# EAGLE schematic untitled3 (EAGLE 9.6.2)
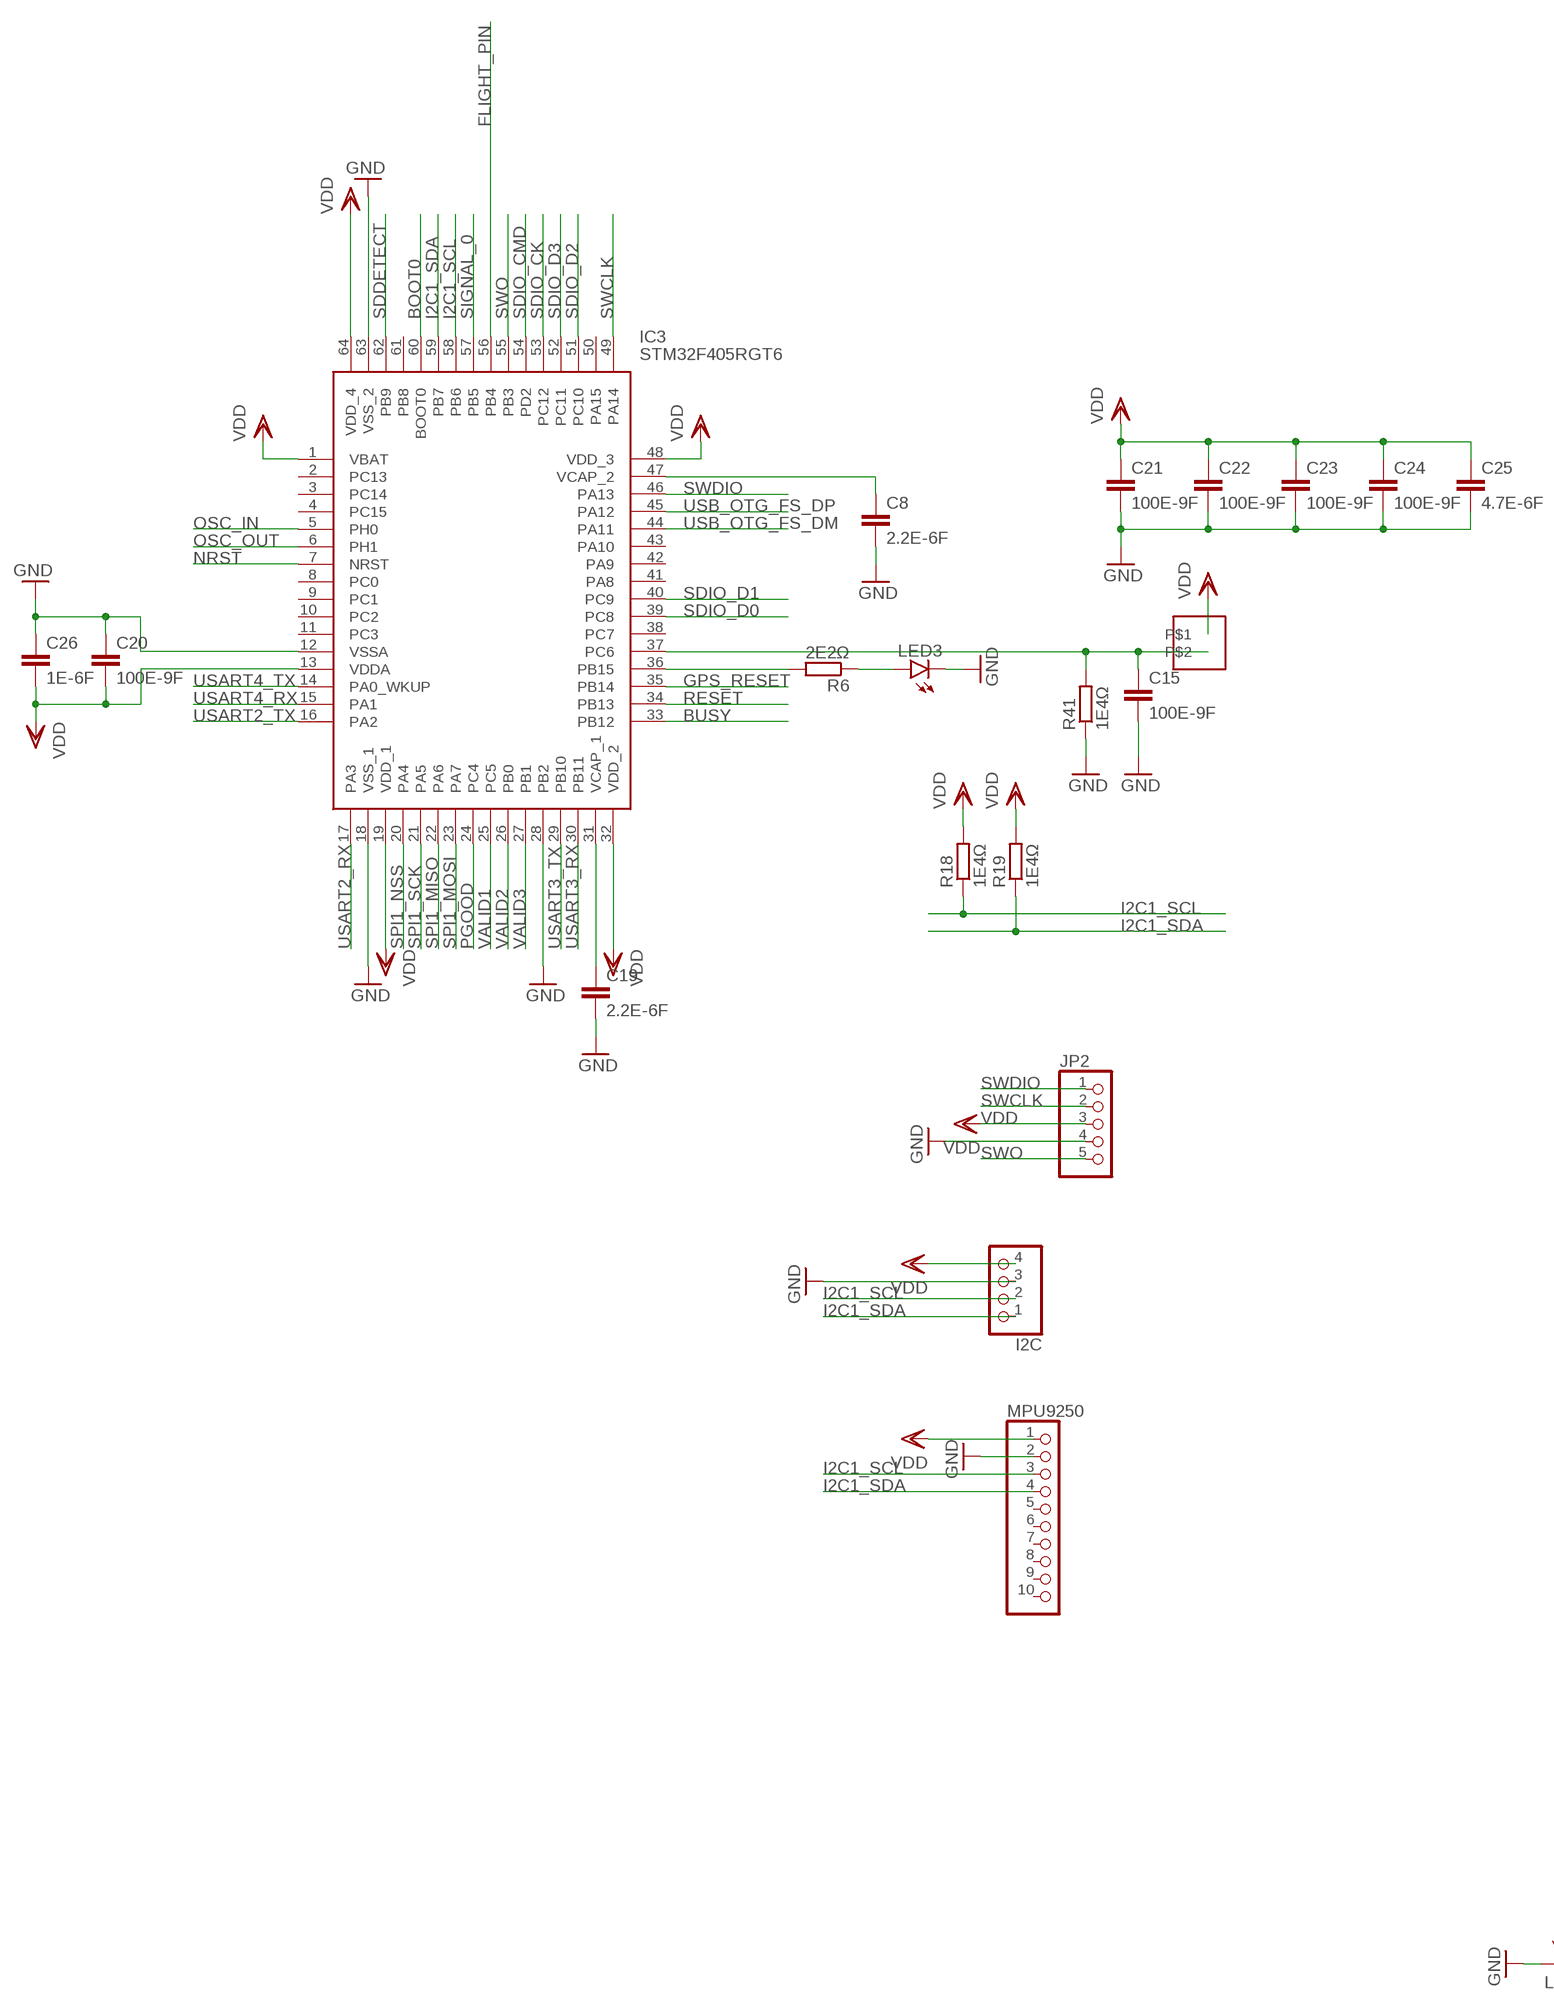
[diagram p0: schematic, sheet 1, part 1 of 2]
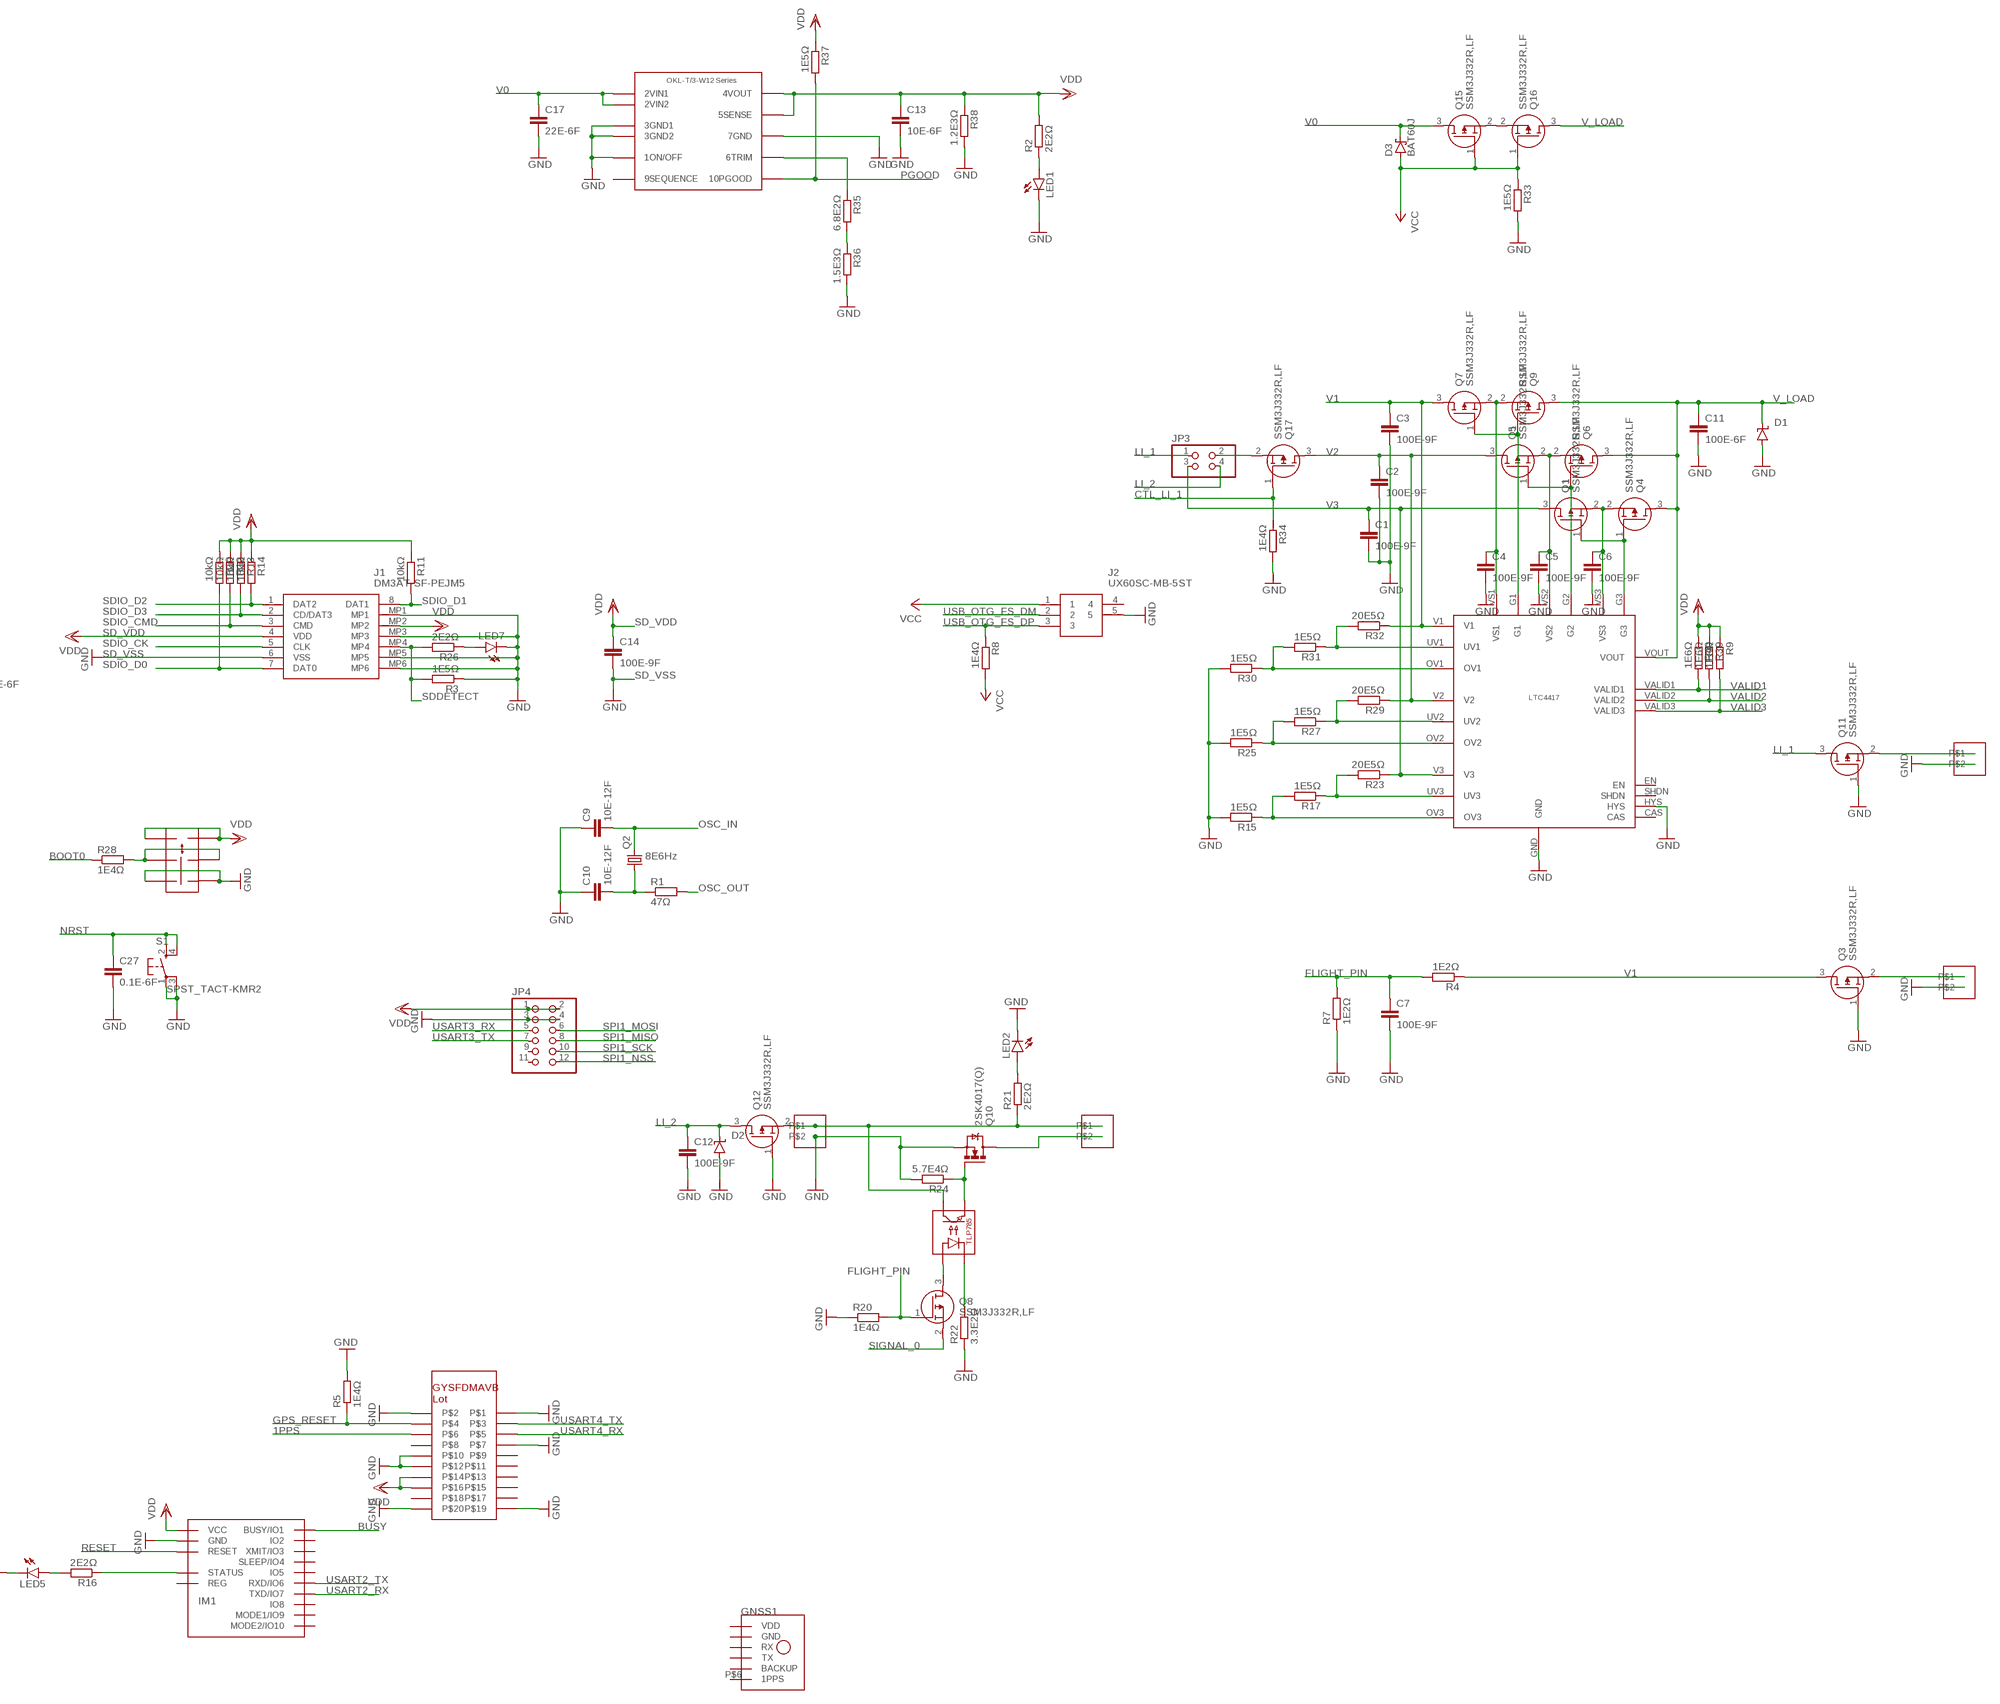
[diagram p1: schematic, sheet 1, part 2 of 2]

## Parts
C1  100E-9F  C-EUC0805  [C0805]
C2  100E-9F  C-EUC0805  [C0805]
C3  100E-9F  C-EUC0805  [C0805]
C4  100E-9F  C-EUC0805  [C0805]
C5  100E-9F  C-EUC0805  [C0805]
C6  100E-9F  C-EUC0805  [C0805]
C7  100E-9F  C-EUC0805  [C0805]
C8  2.2E-6F  C-EUC0805  [C0805]
C9  10E-12F  C-EUC0805  [C0805]
C10  10E-12F  C-EUC0805  [C0805]
C11  100E-6F  C-EUC0805  [C0805]
C12  100E-9F  C-EUC0805  [C0805]
C13  10E-6F  C-EUC0805  [C0805]
C14  100E-9F  C-EUC0805  [C0805]
C15  100E-9F  C-EUC0805  [C0805]
C17  22E-6F  C-EUC0805  [C0805]
C19  2.2E-6F  C-EUC0805  [C0805]
C20  100E-9F  C-EUC0805  [C0805]
C21  100E-9F  C-EUC0805  [C0805]
C22  100E-9F  C-EUC0805  [C0805]
C23  100E-9F  C-EUC0805  [C0805]
C24  100E-9F  C-EUC0805  [C0805]
C25  4.7E-6F  C-EUC0805  [C0805]
C26  1E-6F  C-EUC0805  [C0805]
C27  0.1E-6F  C-EUC0805  [C0805]
D1  SUPPRESSOR-SMBJ  [SMBJ]
D2  SUPPRESSOR-SMBJ  [SMBJ]
D3  BAT60J  [SOD323_ST]
GNSS1  GYSFDMAXB  [GYSFDMAXB]
I2C  PINHD-1X4  [1X04]
IC3  STM32F405RGT6  [QFP50P1200X1200X160-64N]
IM1  IM920C  [IM920C]
J1  DM3AT-SF-PEJM5  [DM3ATSFPEJM5]
J2  UX60SC-MB-5ST  [UX60SC-MB-5ST]
JP2  PINHD-1X5  [1X05]
JP3  PINHD-2X2  [2X02]
JP4  PINHD-2X6  [2X06]
LED1  LEDCHIP-LED0805  [CHIP-LED0805]
LED2  LEDCHIP-LED0805  [CHIP-LED0805]
LED3  LEDCHIP-LED0805  [CHIP-LED0805]
LED5  LEDCHIP-LED0805  [CHIP-LED0805]
LED7  LEDCHIP-LED0805  [CHIP-LED0805]
MPU9250  PINHD-1X10  [1X10]
Q1  SSM3J332R,LF  [2-3Z1S(SOT-23F)]
Q2  CRYSTALCTS406  [CTS406]
Q3  SSM3J332R,LF  [2-3Z1S(SOT-23F)]
Q4  SSM3J332R,LF  [2-3Z1S(SOT-23F)]
Q5  SSM3J332R,LF  [2-3Z1S(SOT-23F)]
Q6  SSM3J332R,LF  [2-3Z1S(SOT-23F)]
Q7  SSM3J332R,LF  [2-3Z1S(SOT-23F)]
Q8  SSM3J332R,LF  [2-3Z1S(SOT-23F)]
Q9  SSM3J332R,LF  [2-3Z1S(SOT-23F)]
Q10  2SK4017(Q)  [TO230P230X650X740-3P]
Q11  SSM3J332R,LF  [2-3Z1S(SOT-23F)]
Q12  SSM3J332R,LF  [2-3Z1S(SOT-23F)]
Q15  SSM3J332R,LF  [2-3Z1S(SOT-23F)]
Q16  SSM3J332R,LF  [2-3Z1S(SOT-23F)]
Q17  SSM3J332R,LF  [2-3Z1S(SOT-23F)]
R1  47Ω  R-EU_R0603  [R0603]
R2  2E2Ω  R-EU_R0603  [R0603]
R3  1E5Ω  R-EU_R0603  [R0603]
R4  1E2Ω  R-EU_R0603  [R0603]
R5  1E4Ω  R-EU_R0603  [R0603]
R6  2E2Ω  R-EU_R0603  [R0603]
R7  1E2Ω  R-EU_R0603  [R0603]
R8  1E4Ω  R-EU_R0603  [R0603]
R9  1E6Ω  R-EU_R0603  [R0603]
R10  10kΩ  R-EU_R0603  [R0603]
R11  10kΩ  R-EU_R0603  [R0603]
R12  10kΩ  R-EU_R0603  [R0603]
R13  10kΩ  R-EU_R0603  [R0603]
R14  10kΩ  R-EU_R0603  [R0603]
R15  1E5Ω  R-EU_R0603  [R0603]
R16  2E2Ω  R-EU_R0603  [R0603]
R17  1E5Ω  R-EU_R0603  [R0603]
R18  1E4Ω  R-EU_R0603  [R0603]
R19  1E4Ω  R-EU_R0603  [R0603]
R20  1E4Ω  R-EU_R0603  [R0603]
R21  2E2Ω  R-EU_R0603  [R0603]
R22  3.3E2Ω  R-EU_R0603  [R0603]
R23  20E5Ω  R-EU_R0603  [R0603]
R24  5.7E4Ω  R-EU_R0603  [R0603]
R25  1E5Ω  R-EU_R0603  [R0603]
R26  2E2Ω  R-EU_R0603  [R0603]
R27  1E5Ω  R-EU_R0603  [R0603]
R28  1E4Ω  R-EU_R0603  [R0603]
R29  20E5Ω  R-EU_R0603  [R0603]
R30  1E5Ω  R-EU_R0603  [R0603]
R31  1E5Ω  R-EU_R0603  [R0603]
R32  20E5Ω  R-EU_R0603  [R0603]
R33  1E5Ω  R-EU_R0603  [R0603]
R34  1E4Ω  R-EU_R0603  [R0603]
R35  6.8E2Ω  R-EU_R0603  [R0603]
R36  1.5E3Ω  R-EU_R0603  [R0603]
R37  1E5Ω  R-EU_R0603  [R0603]
R38  1.2E3Ω  R-EU_R0603  [R0603]
R39  1E6Ω  R-EU_R0603  [R0603]
R40  1E6Ω  R-EU_R0603  [R0603]
R41  1E4Ω  R-EU_R0603  [R0603]
S1  SPST_TACT-KMR2  [KMR2]
TRANSISTER2  TLP785  [TLP785]
U$1  B2B-XH-A  [B2B-XH-A]
U$2  LTC4417  [LTC4417]
U$3  OKL-T/3-W12SERIES  [OKL-T/3-W12SERIES]
U$4  GYSFDMAXB_LOT  [GYSFDMAXB_LOT]
U$6  B2B-XH-A  [B2B-XH-A]
U$7  B2B-XH-A  [B2B-XH-A]
U$8  B2B-XH-A  [B2B-XH-A]
U$9  SSSS213202  [SSSS213202]
U$10  B2B-XH-A  [B2B-XH-A]

## Nets
1PPS: U$4.P$6
BOOT0: IC3.60(BOOT0) R28.1
BUSY: IC3.33(PB12) IM1.$P1(BUSY/IO1)
CTL_LI_1: Q17.1(G) R34.1
FLIGHT_PIN: C7.1 IC3.56(PB4) Q8.1(G) R4.2 R7.2 R20.2
GND [VCC]: C1.2 C2.2 C3.2 C4.2 C5.2 C6.2 C7.2 C8.2 C9.1 C10.1 C11.2 C12.2 C13.2 C14.2 C15.2 C17.2 C19.2 C20.1 C21.2 C22.2 C23.2 C24.2 C25.2 C26.1 C27.2 D1.A D2.A I2C.3 IC3.12(VSSA) IC3.18(VSS_1) IC3.28(PB2) IC3.63(VSS_2) IM1.$P18(GND) J1.6(VSS) J1.MP1 J1.MP3 J1.MP5 J1.MP6 J2.5 JP2.4 JP4.3 JP4.4 LED1.C LED2.C LED3.C LED5.C LED7.C MPU9250.2 Q3.1(G) Q10.3(S) Q11.1(G) Q12.1(G) R3.1 R5.2 R7.1 R15.2 R20.1 R22.1 R24.2 R25.2 R30.2 R33.2 R34.2 R36.2 R38.2 R41.1 S1.1(P) S1.3(P1) U$1.P$2 U$2.GND U$2.HYS U$3.1ON/OFF U$3.3GND1 U$3.3TGND2(3GND2) U$3.7GND U$4.P$1 U$4.P$2 U$4.P$7 U$4.P$10 U$4.P$12 U$4.P$19 U$4.P$20 U$6.P$2 U$8.P$2 U$9.P$5 U$9.P$6
GPS_RESET: IC3.35(PB14) R5.1 U$4.P$4
I2C1_SCL: I2C.2 IC3.58(PB6) MPU9250.3 R18.1
I2C1_SDA: I2C.1 IC3.59(PB7) MPU9250.4 R19.1
LI_1: JP3.1 Q11.3(D)
LI_2: C12.1 D2.C JP3.4 Q12.3(D)
N$1: LED5.A R16.2
N$2: LED1.A R2.1
N$3: IC3.36(PB15) R6.2
N$4: Q11.2(S) U$1.P$1
N$5 [VCC]: C15.1 IC3.37(PC6) R41.2 U$10.P$2
N$6: R15.1 R17.2 U$2.OV3
N$7: C10.2 Q2.1 R1.1
N$8: LED3.A R6.1
N$9: R17.1 R23.2 U$2.UV3
N$10: Q1.1(G) Q4.1(G) U$2.G3
N$11: R30.1 R31.2 U$2.OV1
N$12: R31.1 R32.2 U$2.UV1
N$13: R28.2 U$9.P$3 U$9.P$4
N$14 [VCC]: Q10.2(D) U$7.P$2
N$15: R27.1 R29.2 U$2.UV2
N$16: R25.1 R27.2 U$2.OV2
N$17: C6.1 Q1.2(S) Q4.2(S) U$2.VS3
N$18 [VIN]: Q3.2(S) U$6.P$1
N$20: Q12.2(S) R21.1 TRANSISTER2.P$3 U$7.P$1 U$8.P$1
N$21: C5.1 Q5.2(S) Q6.2(S) U$2.VS2
N$22: Q5.1(G) Q6.1(G) U$2.G2
N$23: C4.1 Q7.2(S) Q9.2(S) U$2.VS1
N$24: Q7.1(G) Q9.1(G) U$2.G1
N$27: R35.1 U$3.6TRIM
N$28: Q15.2(S) Q16.2(S)
N$30: IM1.$P15(STATUS) R16.1
N$31: R35.2 R36.1
N$32: Q8.3(D) TRANSISTER2.P$1
N$35: Q10.1(G) R24.1 TRANSISTER2.P$4
N$39: JP3.2 Q17.2(S)
N$41: LED2.A R21.2
N$42: R22.2 TRANSISTER2.P$2
N$43 [VCC]: LED7.A R26.1
N$45 [VCC]: C19.1 IC3.31(VCAP_1)
N$46 [VCC]: C8.1 IC3.47(VCAP_2)
NRST: C27.1 IC3.7(NRST) S1.2(S) S1.4(S1)
OSC_IN: C9.2 IC3.5(PH0) Q2.3
OSC_OUT: IC3.6(PH1) R1.2
PGOOD: IC3.24(PC4) R37.2 U$3.10PGOOD
RESET: IC3.34(PB13) IM1.$P19(RESET)
SDDETECT: IC3.62(PB9) J1.MP4 R3.2 R26.2
SDIO_CK: IC3.53(PC12) J1.5(CLK)
SDIO_CMD: IC3.54(PD2) J1.3(CMD) R12.2
SDIO_D0: IC3.39(PC8) J1.7(DAT0) R10.2
SDIO_D1: IC3.40(PC9) J1.8(DAT1) R11.2
SDIO_D2: IC3.51(PC10) J1.1(DAT2) R14.2
SDIO_D3: IC3.52(PC11) J1.2(CD/DAT3) R13.2
SIGNAL_0: IC3.57(PB5) Q8.2(S)
SPI1_MISO: IC3.22(PA6) JP4.8
SPI1_MOSI: IC3.23(PA7) JP4.6
SPI1_NSS: IC3.20(PA4) JP4.12
SPI1_SCK: IC3.21(PA5) JP4.10
SWCLK: IC3.49(PA14) JP2.2
SWDIO: IC3.46(PA13) JP2.1
SWO: IC3.55(PB3) JP2.5
USART2_RX: IC3.17(PA3) IM1.$P7(TXD/IO7)
USART2_TX: IC3.16(PA2) IM1.$P6(RXD/IO6)
USART3_RX: IC3.30(PB11) JP4.5
USART3_TX: IC3.29(PB10) JP4.7
USART4_RX: IC3.15(PA1) U$4.P$5
USART4_TX: IC3.14(PA0_WKUP) U$4.P$3
USB_OTG_FS_DM: IC3.44(PA11) J2.2
USB_OTG_FS_DP: IC3.45(PA12) J2.3 R8.1
V0: C17.1 D3.C Q15.3(D) U$3.2VIN1 U$3.2VIN2
V1: C3.1 Q3.3(D) Q7.3(D) R4.1 R32.1 U$2.V1
V2: C2.1 Q5.3(D) Q17.3(D) R29.1 U$2.V2
V3: C1.1 JP3.3 Q1.3(D) R23.1 U$2.V3
V_LOAD: C11.1 D1.C Q4.3(D) Q6.3(D) Q9.3(D) Q16.3(D) U$2.VOUT
VALID1: IC3.25(PC5) R40.2 U$2.VALID1
VALID2: IC3.26(PB0) R39.2 U$2.VALID2
VALID3: IC3.27(PB1) R9.2 U$2.VALID3
VCC [VCC]: D3.A J2.1 Q15.1(G) Q16.1(G) R8.2 R33.1
VDD [VDD]: C13.1 C14.1 C20.2 C21.1 C22.1 C23.1 C24.1 C25.1 C26.2 I2C.4 IC3.1(VBAT) IC3.13(VDDA) IC3.19(VDD_1) IC3.32(VDD_2) IC3.48(VDD_3) IC3.64(VDD_4) IM1.$P17(VCC) J1.4(VDD) J1.MP2 JP2.3 JP4.1 JP4.2 MPU9250.1 R2.2 R9.1 R10.1 R11.1 R12.1 R13.1 R14.1 R18.2 R19.2 R37.1 R38.1 R39.1 R40.1 U$3.4VOUT U$3.5SENSE U$4.P$14 U$4.P$16 U$9.P$1 U$9.P$2 U$10.P$1
Unconnected: GNSS1.P$1(GND) GNSS1.P$2(GND) GNSS1.P$3(RX) GNSS1.P$5(TX) GNSS1.P$6(1PPS) GNSS1.P$7(GND) GNSS1.P$10(GND) GNSS1.P$12(GND) GNSS1.P$14(BACKUP) GNSS1.P$16(VDD) GNSS1.P$19(GND) GNSS1.P$20(GND) IC3.2(PC13) IC3.3(PC14) IC3.4(PC15) IC3.8(PC0) IC3.9(PC1) IC3.10(PC2) IC3.11(PC3) IC3.38(PC7) IC3.41(PA8) IC3.42(PA9) IC3.43(PA10) IC3.50(PA15) IC3.61(PB8) IM1.$P2(IO2) IM1.$P3(XMIT/IO3) IM1.$P4(SLEEP/IO4) IM1.$P5(IO5) IM1.$P8(IO8) IM1.$P9(MODE1/IO9) IM1.$P10(MODE2/IO10) IM1.$P16(REG) J2.4 JP4.9 JP4.11 MPU9250.5 MPU9250.6 MPU9250.7 MPU9250.8 MPU9250.9 MPU9250.10 U$2.CAS U$2.EN U$2.SHDN U$3.9SEQUENCE U$4.P$8 U$4.P$9 U$4.P$11 U$4.P$13 U$4.P$15 U$4.P$17 U$4.P$18

## Notes on the sheet
- SD_VDD
- SD_VDD
- SD_VSS
- SD_VSS
- 8E6Hz

## Library data of the parts
C1-C15 C17 C19-C27 = rcl:C-EU: CAPACITOR, European symbol; SPICEPREFIX: C
D1 D2 = diode:SUPPRESSOR-: Suppressor diode
D3 = diode:BAT60J: Schottky barrier diode Source: www.st.com, BAT60J.pdf
GNSS1 = GYSFDMAXB:GYSFDMAXB
I2C = pinhead:PINHD-1X4: PIN HEADER
IC3 = SamacSys_Parts:STM32F405RGT6: MCU 32-Bit, ARM Cortex M4, 1MB Flash STMicroelectronics STM32F405RGT6, 32bit ARM Cortex M4F Microcontroller, 168MHz, 1024 kB Flash, 64-Pin LQFP Source: Datasheet <http://www.st.com/web/en/resource/technical/document/datasheet/DM00037051.pdf>; DESCRIPTION: MCU 32-Bit, ARM Cortex M4, 1MB Flash STMicroelectronics STM32F405RGT6, 32bit ARM Cortex M4F Microcontroller, 168MHz, 1024 kB Flash, 64-Pin LQFP; HEIGHT: 1.6mm; MANUFACTURER_NAME: STMicroelectronics; MANUFACTURER_PART_NUMBER: STM32F405RGT6; MOUSER_PART_NUMBER: 511-STM32F405RGT6; MOUSER_PRICE-STOCK: https://www.mouser.co.uk/ProductDetail/STMicroelectronics/STM32F405RGT6?qs=Z8%252BeY1k3TIKgj7QWsYGpQw%3D%3D
IM1 = IM920:IM920C
J1 = SamacSys_Parts:DM3AT-SF-PEJM5: Memory Card Connectors R/A SMT MICROSD CON PUSH-PUSH TOP BRDMNT Source: Datasheet <https://datasheet.lcsc.com/szlcsc/Hirose-HRS-DM3AT-SF-PEJM5_C114218.pdf>; DESCRIPTION: Memory Card Connectors R/A SMT MICROSD CON PUSH-PUSH TOP BRDMNT; HEIGHT: 1.83mm; MANUFACTURER_NAME: Hirose; MANUFACTURER_PART_NUMBER: DM3AT-SF-PEJM5; MOUSER_PART_NUMBER: 798-DM3AT-SF-PEJM5; MOUSER_PRICE-STOCK: https://www.mouser.co.uk/ProductDetail/Hirose-Connector/DM3AT-SF-PEJM5/?qs=LZSZKJVF%252B2WTDKp%252BR7IYAQ%3D%3D
J2 = SamacSys_Parts:UX60SC-MB-5ST: Hirose UX60 Series Right Angle SMT Version 2.0 Type B Mini USB Connector Receptacle, 30 V ac, 1A Source: Datasheet; DESCRIPTION: Hirose UX60 Series Right Angle SMT Version 2.0 Type B Mini USB Connector Receptacle, 30 V ac, 1A; HEIGHT: mm; MANUFACTURER_NAME: Hirose; MANUFACTURER_PART_NUMBER: UX60SC-MB-5ST; MOUSER_PART_NUMBER: 798-UX60SC-MB-5ST; MOUSER_PRICE-STOCK: https://www.mouser.co.uk/ProductDetail/Hirose-Connector/UX60SC-MB-5ST?qs=XQjbzJWzFPVAXBHee%2FyNFw%3D%3D
JP2 = pinhead:PINHD-1X5: PIN HEADER
JP3 = pinhead:PINHD-2X2: PIN HEADER
JP4 = pinhead:PINHD-2X6: PIN HEADER
LED1-LED3 LED5 LED7 = led:LED: LED OSRAM: - CHIPLED LG R971, LG N971, LY N971, LG Q971, LY Q971, LO R971, LY R971 LH N974, LH R974 LS Q976, LO Q976, LY Q976 LO Q996 - Hyper CHIPLED LW Q18S LB Q993, LB Q99A, LB R99A - SideLED LS A670, LO A670, LY A670, LG A670, LP A670 LB A673, LV A673, LT A673, LW A673 LH A674 LY A675 LS A676, LA A676, LO A676, LY A676, LW A676 LS A679, LY A679, LG A679 - Hyper Micro SIDELED® LS Y876, LA Y876, LO Y876, LY Y876 LT Y87S - SmartLED LW L88C, LW L88S LB L89C, LB L89S, LG L890 LS L89K, LO L89K, LY L89K LS L896, LA L896, LO L896, LY L896 - TOPLED LS T670, LO T670, LY T670, LG T670, LP T670 LSG T670, LSP T670, LSY T670, LOP T670, LYG T670 LG T671, LOG T671, LSG T671 LB T673, LV T673, LT T673, LW T673 LH T674 LS T676, LA T676, LO T676, LY T676, LB T676, LH T676, LSB T676, LW T676 LB T67C, LV T67C, LT T67C, LS T67K, LO T67K, LY T67K, LW E67C LS E67B, LA E67B, LO E67B, LY E67B, LB E67C, LV E67C, LT E67C LW T67C LS T679, LY T679, LG T679 LS T770, LO T770, LY T770, LG T770, LP T770 LB T773, LV T773, LT T773, LW T773 LH T774 LS E675, LA E675, LY E675, LS T675 LS T776, LA T776, LO T776, LY T776, LB T776 LHGB T686 LT T68C, LB T68C - Hyper Mini TOPLED® LB M676 - Mini TOPLED Santana® LG M470 LS M47K, LO M47K, LY M47K Source: http://www.osram.convergy.de LUXEON: - LUMILED® LXK2-PW12-R00, LXK2-PW12-S00, LXK2-PW14-U00, LXK2-PW14-V00 LXK2-PM12-R00, LXK2-PM12-S00, LXK2-PM14-U00 LXK2-PE12-Q00, LXK2-PE12-R00, LXK2-PE12-S00, LXK2-PE14-T00, LXK2-PE14-U00 LXK2-PB12-K00, LXK2-PB12-L00, LXK2-PB12-M00, LXK2-PB14-N00, LXK2-PB14-P00, LXK2-PB14-Q00 LXK2-PR12-L00, LXK2-PR12-M00, LXK2-PR14-Q00, LXK2-PR14-R00 LXK2-PD12-Q00, LXK2-PD12-R00, LXK2-PD12-S00 LXK2-PH12-R00, LXK2-PH12-S00 LXK2-PL12-P00, LXK2-PL12-Q00, LXK2-PL12-R00 Source: www.luxeon.com KINGBRIGHT: KA-3528ASYC Source: www.kingbright.com
MPU9250 = pinhead:PINHD-1X10: PIN HEADER
Q1 Q3-Q9 Q11 Q12 Q15-Q17 = SamacSys_Parts:SSM3J332R,LF: MOSFET SM Sig P-CH MOS 12V VGSS -6A -30VDSS Source: Datasheet; DESCRIPTION: MOSFET SM Sig P-CH MOS 12V VGSS -6A -30VDSS; HEIGHT: mm; MANUFACTURER_NAME: Toshiba; MANUFACTURER_PART_NUMBER: SSM3J332R,LF; MOUSER_PART_NUMBER: 757-SSM3J332RLF; MOUSER_PRICE-STOCK: https://www.mouser.co.uk/ProductDetail/Toshiba/SSM3J332RLF?qs=%252B8yZ8wZTKG5UW86maIHWeg%3D%3D
Q2 = crystal:CRYSTAL: CRYSTAL; OC_FARNELL: unknown; OC_NEWARK: unknown
Q10 = 2SK4017_Q_:2SK4017(Q): Trans MOSFET N-CH 60V 5A 3-Pin(3+Tab) PW-Mold2 Check prices <https://pricing.snapeda.com/parts/2SK4017%28Q%29/Toshiba%20Semiconductor/view-part?ref=eda>; AVAILABILITY: Warning; DESCRIPTION: N-Channel 60V 5A (Ta) 20W (Tc) Through Hole PW-MOLD2; MF: Toshiba Semiconductor; MP: 2SK4017(Q); PACKAGE: TO-251 Toshiba; PRICE: None
R1-R41 = rcl:R-EU_: RESISTOR, European symbol; SPICEPREFIX: R
S1 = adafruit:SPST_TACT: SMT 6mm switch, EVQQ2 series http://www.ladyada.net/library/eagle
TRANSISTER2 = untitled:TLP785
U$1 U$6-U$8 U$10 = untitled:B2B-XH-A
U$2 = untitled:LTC4417
U$3 = untitled:OKL-T/3-W12SERIES
U$4 = untitled:GYSFDMAXB_LOT
U$9 = untitled:SSSS213202

## Net classes
1 supply: width 0.15 mm
2 VDD: width 0.254 mm
3 VCC: width 0.305 mm
4 VIN: width 0.61 mm